# EAGLE design FAL65816_Backplane (EAGLE 7.2.0)
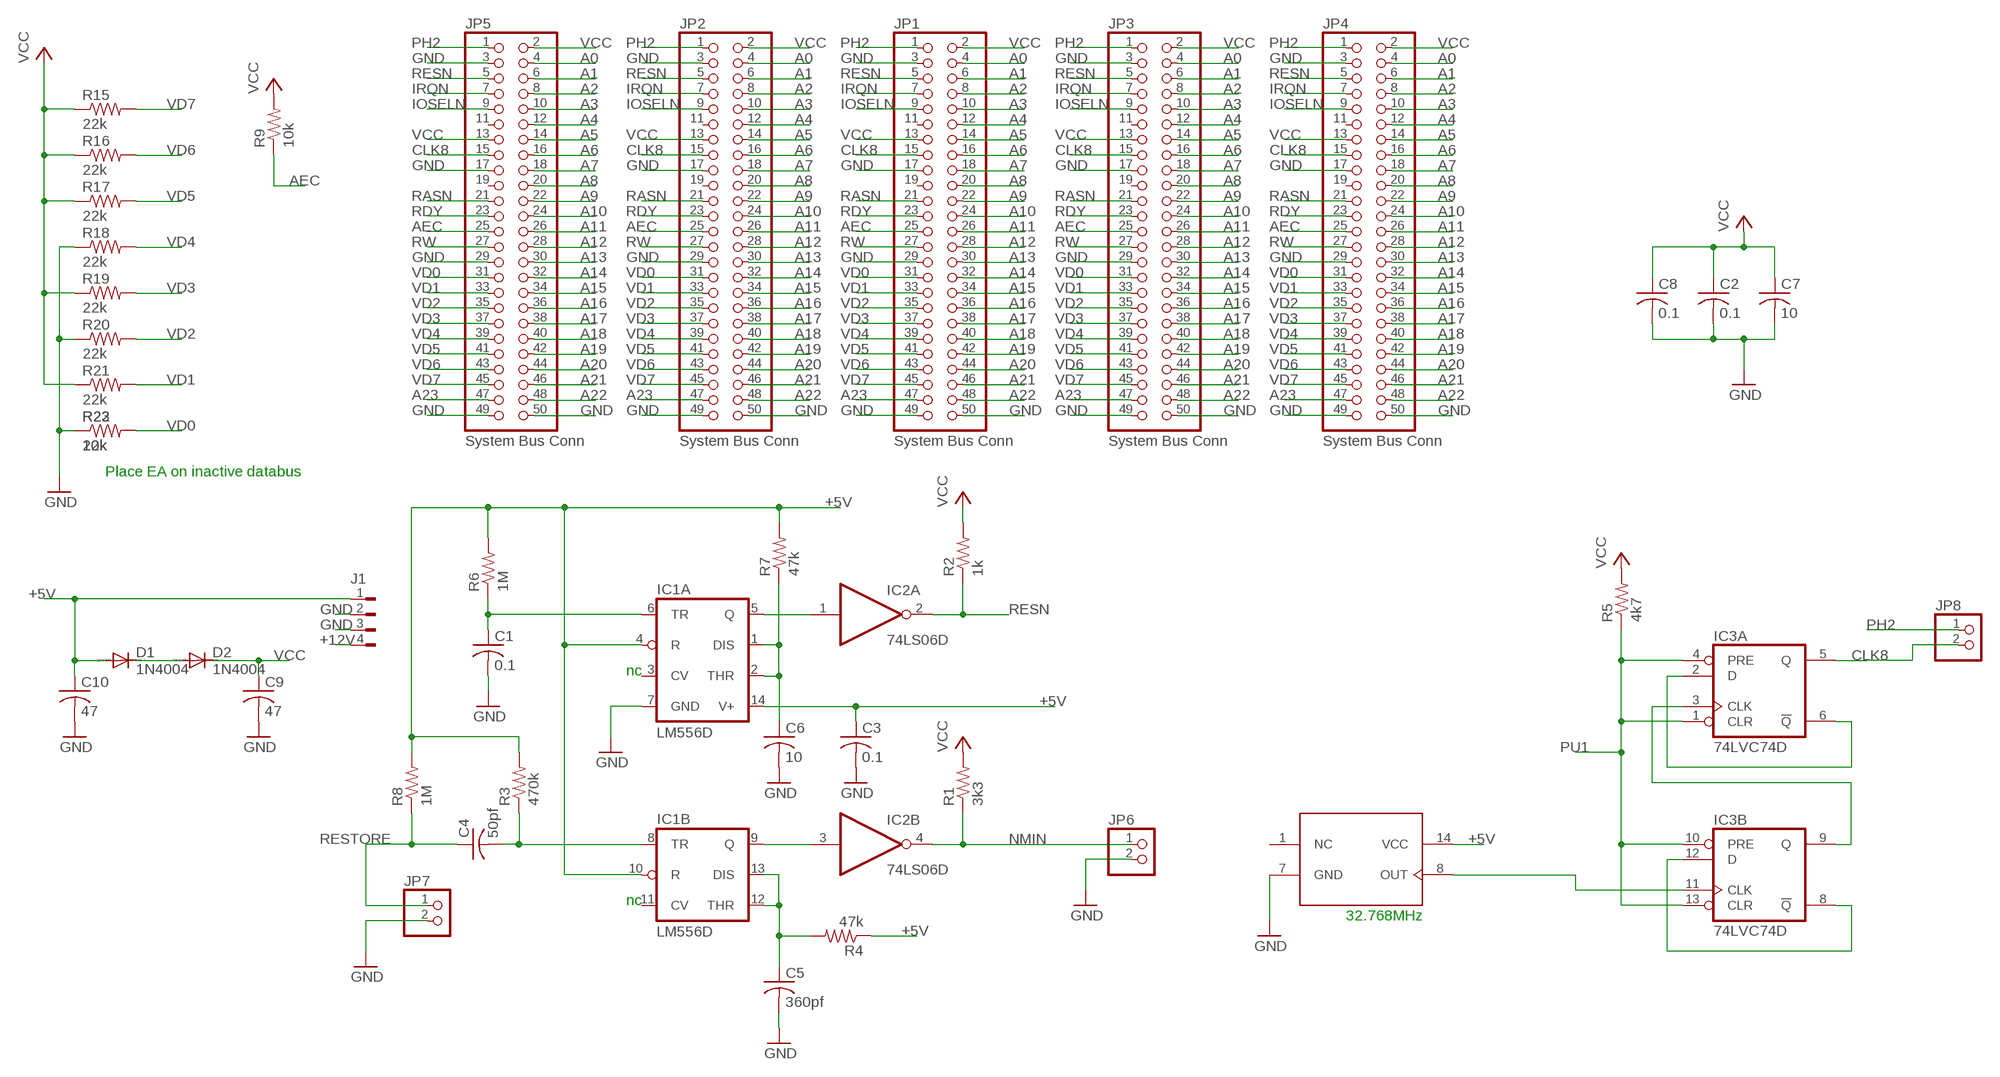
[diagram p0: schematic, sheet 1]

## Parts
C1  0.1  C-US050-024X044  [C050-024X044]
C2  0.1  C-US050-024X044  [C050-024X044]
C3  0.1  C-US050-024X044  [C050-024X044]
C4  50pf  C-US050-024X044  [C050-024X044]
C5  360pf  C-US050-024X044  [C050-024X044]
C6  10  C-US050-024X044  [C050-024X044]
C7  10  C-US050-024X044  [C050-024X044]
C8  0.1  C-US050-024X044  [C050-024X044]
C9  47  C-US050-024X044  [C050-024X044]
C10  47  C-US050-024X044  [C050-024X044]
D1  1N4004  [DO41-10]
D2  1N4004  [DO41-10]
IC1  LM556D  [SO14]
IC2  74LS06D  [SO14]
IC3  74LVC74D  74LS74D  [SO14]
J1  FLOPPY-4  [FLOPPY-4]
JP1  System Bus Conn  PINHD-2X25  [2X25]
JP2  System Bus Conn  PINHD-2X25  [2X25]
JP3  System Bus Conn  PINHD-2X25  [2X25]
JP4  System Bus Conn  PINHD-2X25  [2X25]
JP5  System Bus Conn  PINHD-2X25  [2X25]
JP6  PINHD-1X2  [1X02]
JP7  PINHD-1X2  [1X02]
JP8  PINHD-1X2  [1X02]
R1  3k3  R-US_0204/7  [0204/7]
R2  1k  R-US_0204/7  [0204/7]
R3  470k  R-US_0204/7  [0204/7]
R4  47k  R-US_0204/7  [0204/7]
R5  4k7  R-US_0204/7  [0204/7]
R6  1M  R-US_0204/7  [0204/7]
R7  47k  R-US_0204/7  [0204/7]
R8  1M  R-US_0204/7  [0204/7]
R9  10k  R-US_0204/7  [0204/7]
R15  22k  R-US_0207/10  [0207/10]
R16  22k  R-US_0207/10  [0207/10]
R17  22k  R-US_0207/10  [0207/10]
R18  22k  R-US_0207/10  [0207/10]
R19  22k  R-US_0207/10  [0207/10]
R20  22k  R-US_0207/10  [0207/10]
R21  22k  R-US_0207/10  [0207/10]
R22  10k  R-US_0207/10  [0207/10]
R23  22k  R-US_0207/10  [0207/10]
U$1  OSC14  [DIL14]

## Nets
+5V: C3.1 C10.1 D1.A IC1.4(A:R) IC1.10(B:R) IC1.14(A:V+) J1.1 R3.2 R4.1 R6.2 R7.2 R8.2 U$1.14(VCC)
+12V: J1.4
A0: JP1.4 JP2.4 JP3.4 JP4.4 JP5.4
A1: JP1.6 JP2.6 JP3.6 JP4.6 JP5.6
A2: JP1.8 JP2.8 JP3.8 JP4.8 JP5.8
A3: JP1.10 JP2.10 JP3.10 JP4.10 JP5.10
A4: JP1.12 JP2.12 JP3.12 JP4.12 JP5.12
A5: JP1.14 JP2.14 JP3.14 JP4.14 JP5.14
A6: JP1.16 JP2.16 JP3.16 JP4.16 JP5.16
A7: JP1.18 JP2.18 JP3.18 JP4.18 JP5.18
A8: JP1.20 JP2.20 JP3.20 JP4.20 JP5.20
A9: JP1.22 JP2.22 JP3.22 JP4.22 JP5.22
A10: JP1.24 JP2.24 JP3.24 JP4.24 JP5.24
A11: JP1.26 JP2.26 JP3.26 JP4.26 JP5.26
A12: JP1.28 JP2.28 JP3.28 JP4.28 JP5.28
A13: JP1.30 JP2.30 JP3.30 JP4.30 JP5.30
A14: JP1.32 JP2.32 JP3.32 JP4.32 JP5.32
A15: JP1.34 JP2.34 JP3.34 JP4.34 JP5.34
A16: JP1.36 JP2.36 JP3.36 JP4.36 JP5.36
A17: JP1.38 JP2.38 JP3.38 JP4.38 JP5.38
A18: JP1.40 JP2.40 JP3.40 JP4.40 JP5.40
A19: JP1.42 JP2.42 JP3.42 JP4.42 JP5.42
A20: JP1.44 JP2.44 JP3.44 JP4.44 JP5.44
A21: JP1.46 JP2.46 JP3.46 JP4.46 JP5.46
A22: JP1.48 JP2.48 JP3.48 JP4.48 JP5.48
A23: JP1.47 JP2.47 JP3.47 JP4.47 JP5.47
AEC: JP1.25 JP2.25 JP3.25 JP4.25 JP5.25 R9.1
CLK8: IC3.5(A:Q) JP1.15 JP2.15 JP3.15 JP4.15 JP5.15 JP8.2
GND: C1.2 C2.2 C3.2 C5.2 C6.2 C7.2 C8.2 C9.2 C10.2 IC1.7(A:GND) J1.2 J1.3 JP1.3 JP1.17 JP1.29 JP1.49 JP1.50 JP2.3 JP2.17 JP2.29 JP2.49 JP2.50 JP3.3 JP3.17 JP3.29 JP3.49 JP3.50 JP4.3 JP4.17 JP4.29 JP4.49 JP4.50 JP5.3 JP5.17 JP5.29 JP5.49 JP5.50 JP6.2 JP7.2 R18.1 R20.1 R22.1 R23.1 U$1.7(GND)
IOSELN: JP1.9 JP2.9 JP3.9 JP4.9 JP5.9
IRQN: JP1.7 JP2.7 JP3.7 JP4.7 JP5.7
N$2: IC3.3(A:CLK) IC3.9(B:Q)
N$3: IC1.5(A:Q) IC2.1(A:I)
N$4: IC3.8(B:!Q) IC3.12(B:D)
N$5: IC1.9(B:Q) IC2.3(B:I)
N$6: C1.1 IC1.6(A:TR) R6.1
N$7: IC3.11(B:CLK) U$1.8(OUT)
N$8: IC3.2(A:D) IC3.6(A:!Q)
N$9: R22.2 R23.2
N$10: C6.1 IC1.1(A:DIS) IC1.2(A:THR) R7.1
N$12: C4.2 IC1.8(B:TR) R3.1
N$13: D1.C D2.A
N$14: C5.1 IC1.12(B:THR) IC1.13(B:DIS) R4.2
NMIN: IC2.4(B:O) JP6.1 R1.1
PH2: JP1.1 JP2.1 JP3.1 JP4.1 JP5.1 JP8.1
PU1: IC3.1(A:CLR) IC3.4(A:PRE) IC3.10(B:PRE) IC3.13(B:CLR) R5.1
RASN: JP1.21 JP2.21 JP3.21 JP4.21 JP5.21
RDY: JP1.23 JP2.23 JP3.23 JP4.23 JP5.23
RESN: IC2.2(A:O) JP1.5 JP2.5 JP3.5 JP4.5 JP5.5 R2.1
RESTORE: C4.1 JP7.1 R8.1
RW: JP1.27 JP2.27 JP3.27 JP4.27 JP5.27
VCC: C2.1 C7.1 C8.1 C9.1 D2.C JP1.2 JP1.13 JP2.2 JP2.13 JP3.2 JP3.13 JP4.2 JP4.13 JP5.2 JP5.13 R1.2 R2.2 R5.2 R9.2 R15.1 R16.1 R17.1 R19.1 R21.1
VD0: JP1.31 JP2.31 JP3.31 JP4.31 JP5.31
VD1: JP1.33 JP2.33 JP3.33 JP4.33 JP5.33 R21.2
VD2: JP1.35 JP2.35 JP3.35 JP4.35 JP5.35 R20.2
VD3: JP1.37 JP2.37 JP3.37 JP4.37 JP5.37 R19.2
VD4: JP1.39 JP2.39 JP3.39 JP4.39 JP5.39 R18.2
VD5: JP1.41 JP2.41 JP3.41 JP4.41 JP5.41 R17.2
VD6: JP1.43 JP2.43 JP3.43 JP4.43 JP5.43 R16.2
VD7: JP1.45 JP2.45 JP3.45 JP4.45 JP5.45 R15.2
Unconnected: IC1.3(A:CV) IC1.11(B:CV) IC2.5(C:I) IC2.6(C:O) IC2.8(D:O) IC2.9(D:I) IC2.10(E:O) IC2.11(E:I) IC2.12(F:O) IC2.13(F:I) JP1.11 JP1.19 JP2.11 JP2.19 JP3.11 JP3.19 JP4.11 JP4.19 JP5.11 JP5.19 U$1.1(NC)

## Notes on the sheet
- Place EA on inactive databus
- nc
- nc
- 32.768MHz

## Power pins joined to a net without a drawn wire
GND: IC2.7(P:GND) IC3.7(P:GND)
VCC: IC2.14(P:VCC) IC3.14(P:VCC)

## Library data of the parts
C1-C10 = rcl:C-US: CAPACITOR, American symbol
D1 D2 = diode:1N4004: DIODE general purpose rectifier, 1 A
IC1 = linear:*556: Dual TIMER
IC2 = FT74xx:74*06: Hex INVERTER, open collector high-voltage output
IC3 = FT74xx:74*74: Dual D type positive edge triggered FLIP FLOP, preset and clear
J1 = con-amp:FLOPPY-4: MATE N-LOCK Floppy / HDD conector Distributor: Bürklin 71F970
JP1-JP5 = pinhead:PINHD-2X25: PIN HEADER
JP6-JP8 = pinhead:PINHD-1X2: PIN HEADER
R1-R9 R15-R23 = resistor:R-US_: RESISTOR, American symbol
U$1 = FT74xx:OSC14

## Board
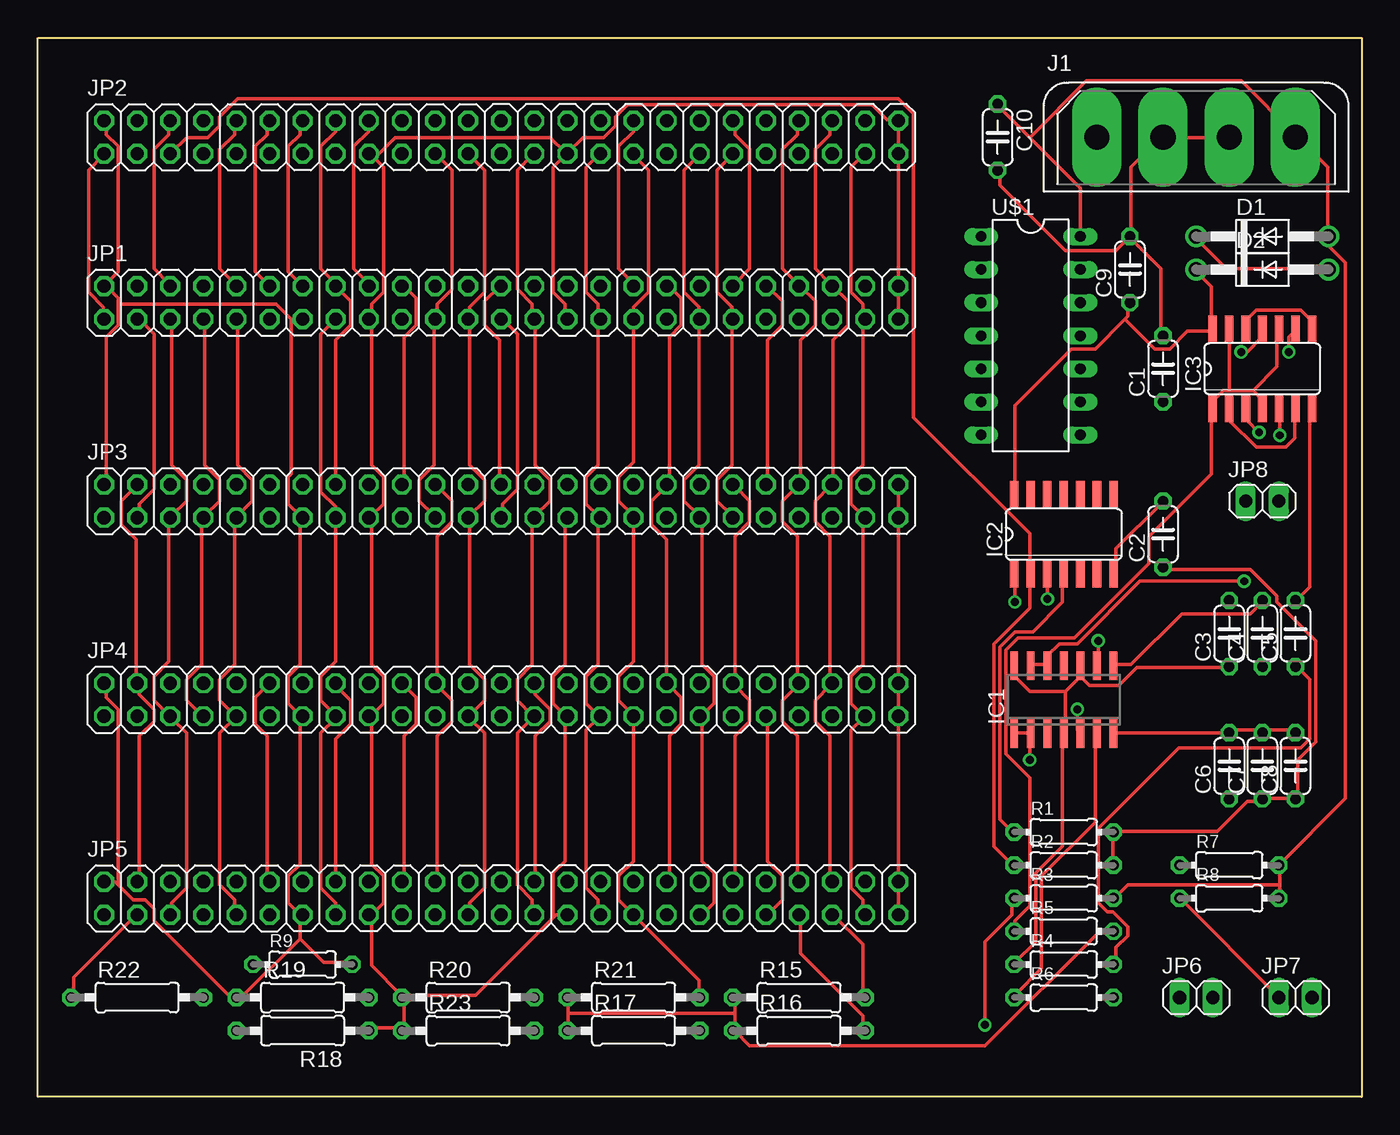
[diagram p1: board, top side]
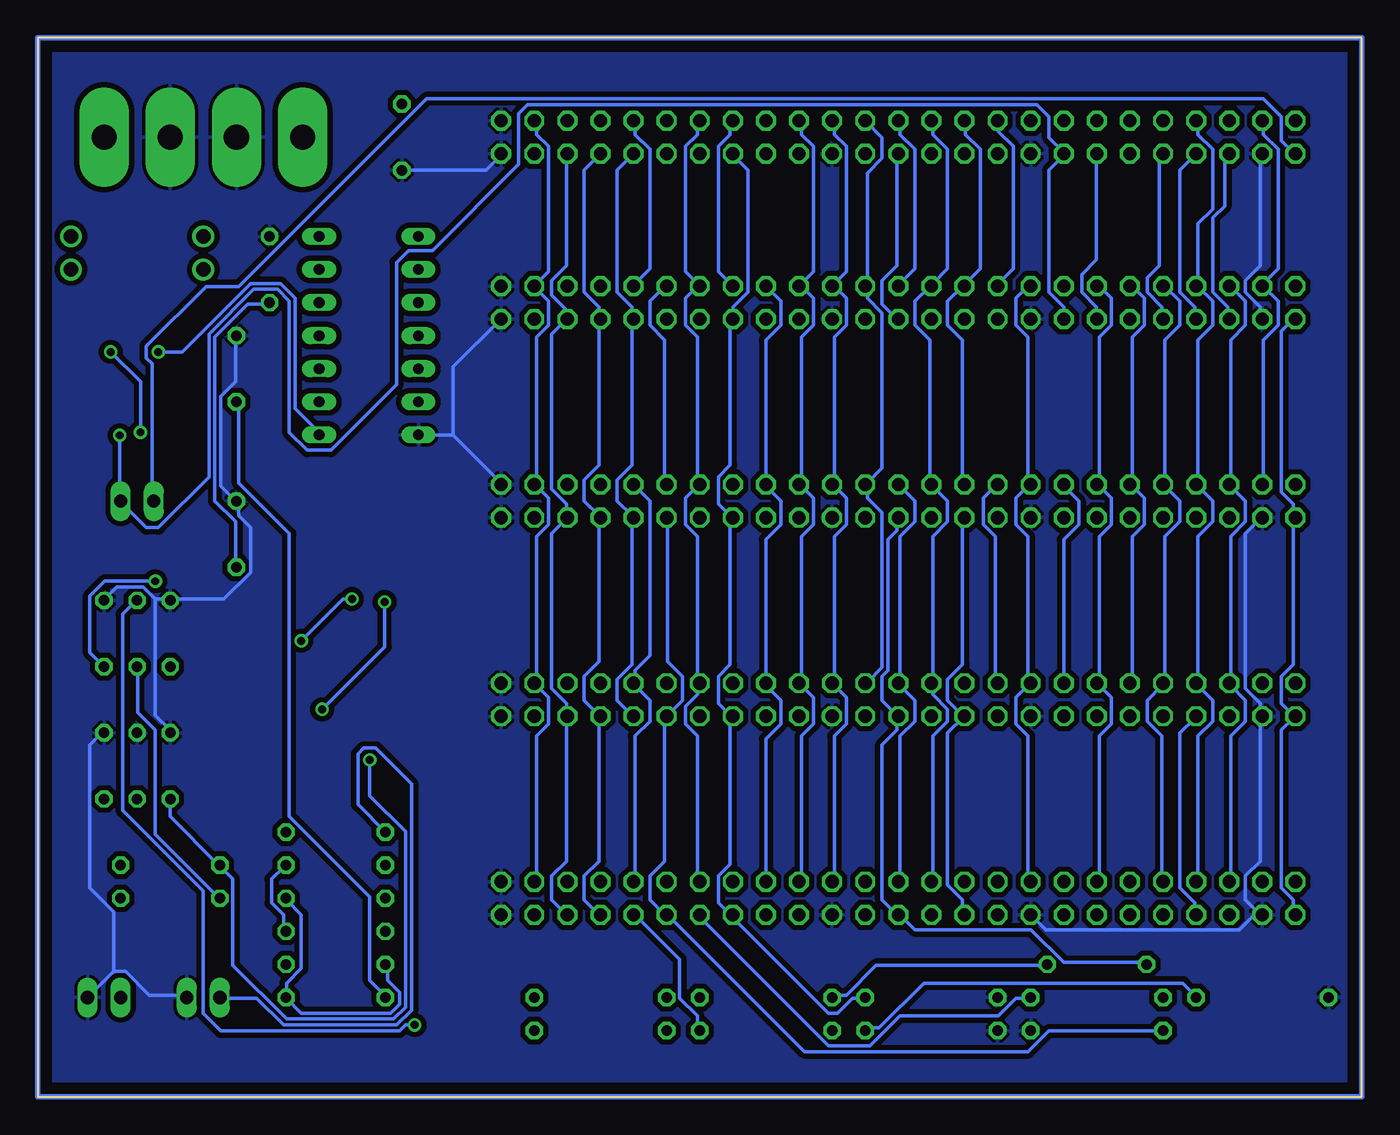
[diagram p2: board, bottom side, seen from below]

Size 101.6 x 81.28 mm. Coordinates in mm from the lower left corner, seen from the top.
Outline: 0,0 0,81.28 101.6,81.28 101.6,0 0,0
Copper layers (1*16): Top 0.035mm / dielectric 1.5mm / Bottom 0.035mm
Design rules "default": minimum track width 10mil, minimum drill 24mil, track to track 8mil, track to pad 8mil, pad to pad 8mil, via to via 8mil, smd to smd 8mil, copper to edge 40mil, drill to drill 8mil, minimum pad ring 10mil, minimum via ring 8mil, stop-mask expansion 4mil, vias tented up to drill 0mil, thermal gap 10mil

### Footprints (pad centres in the part's own frame; a part is rotated, then mirrored left to right if it is on the bottom)
C050-024X044 = drill 0.813 octagon: 1 -2.54,0; 2 2.54,0
DO41-10 = drill 1.118: A 5.08,0; C -5.08,0
SO14 = smd 0.6 x 2.2: 1 -3.81,-2.6; 2 -2.54,-2.6; 3 -1.27,-2.6; 4 0,-2.6; 5 1.27,-2.6; 6 2.54,-2.6; 7 3.81,-2.6; 8 3.81,2.6; 9 2.54,2.6; 10 1.27,2.6; 11 0,2.6; 12 -1.27,2.6; 13 -2.54,2.6; 14 -3.81,2.6
SO14' = smd 0.66 x 2.032: 1 -3.81,-3.073; 2 -2.54,-3.073; 3 -1.27,-3.073; 4 0,-3.073; 5 1.27,-3.073; 6 2.54,-3.073; 7 3.81,-3.073; 8 3.81,3.073; 9 2.54,3.073; 10 1.27,3.073; 11 0,3.073; 12 -1.27,3.073; 13 -2.54,3.073; 14 -3.81,3.073
FLOPPY-4 = drill 1.93 pad 3.81 long: 1 7.62,0; 2 2.54,0; 3 -2.54,0; 4 -7.62,0
2X25 = drill 1.016 octagon: 1 -30.48,-1.27; 2 -30.48,1.27; 3 -27.94,-1.27; 4 -27.94,1.27; 5 -25.4,-1.27; 6 -25.4,1.27; 7 -22.86,-1.27; 8 -22.86,1.27; 9 -20.32,-1.27; 10 -20.32,1.27; 11 -17.78,-1.27; 12 -17.78,1.27; 13 -15.24,-1.27; 14 -15.24,1.27; 15 -12.7,-1.27; 16 -12.7,1.27; 17 -10.16,-1.27; 18 -10.16,1.27; 19 -7.62,-1.27; 20 -7.62,1.27; 21 -5.08,-1.27; 22 -5.08,1.27; 23 -2.54,-1.27; 24 -2.54,1.27; 25 0,-1.27; 26 0,1.27; 27 2.54,-1.27; 28 2.54,1.27; 29 5.08,-1.27; 30 5.08,1.27; 31 7.62,-1.27; 32 7.62,1.27; 33 10.16,-1.27; 34 10.16,1.27; 35 12.7,-1.27; 36 12.7,1.27; 37 15.24,-1.27; 38 15.24,1.27; 39 17.78,-1.27; 40 17.78,1.27; 41 20.32,-1.27; 42 20.32,1.27; 43 22.86,-1.27; 44 22.86,1.27; 45 25.4,-1.27; 46 25.4,1.27; 47 27.94,-1.27; 48 27.94,1.27; 49 30.48,-1.27; 50 30.48,1.27
1X02 = drill 1.016 long: 1 -1.27,0; 2 1.27,0
0204/7 = drill 0.813 octagon: 1 -3.81,0; 2 3.81,0
0207/10 = drill 0.813 octagon: 1 -5.08,0; 2 5.08,0
DIL14 = drill 0.813 long: 1 -7.62,-3.81; 2 -5.08,-3.81; 3 -2.54,-3.81; 4 0,-3.81; 5 2.54,-3.81; 6 5.08,-3.81; 7 7.62,-3.81; 8 7.62,3.81; 9 5.08,3.81; 10 2.54,3.81; 11 0,3.81; 12 -2.54,3.81; 13 -5.08,3.81; 14 -7.62,3.81

### Placement (x,y rotation side)
C1  86.36,55.88 90 top
C2  86.36,43.18 90 top
C3  91.44,35.56 90 top
C4  93.98,35.56 90 top
C5  96.52,35.56 90 top
C6  91.44,25.4 90 top
C7  93.98,25.4 90 top
C8  96.52,25.4 90 top
C9  83.82,63.5 90 top
C10  73.66,73.66 270 top
D1  93.98,66.04 0 top
D2  93.98,63.5 0 top
IC1  78.74,30.48 0 top
IC2  74LS06D  [SO14']  78.74,43.18 0 top
IC3  74LVC74D  [SO14']  93.98,55.88 0 top
J1  88.9,73.66 0 top
JP1  35.56,60.96 0 top
JP2  35.56,73.66 0 top
JP3  35.56,45.72 0 top
JP4  35.56,30.48 0 top
JP5  35.56,15.24 0 top
JP6  88.9,7.62 0 top
JP7  96.52,7.62 0 top
JP8  93.98,45.72 0 top
R1  78.74,20.32 0 top
R2  78.74,17.78 0 top
R3  78.74,15.24 0 top
R4  78.74,10.16 0 top
R5  78.74,12.7 0 top
R6  78.74,7.62 0 top
R7  91.44,17.78 0 top
R8  91.44,15.24 0 top
R9  20.32,10.16 0 top
R15  58.42,7.62 0 top
R16  58.42,5.08 0 top
R17  45.72,5.08 0 top
R18  20.32,5.08 180 top
R19  20.32,7.62 0 top
R20  33.02,7.62 0 top
R21  45.72,7.62 0 top
R22  7.62,7.62 0 top
R23  33.02,5.08 0 top
U$1  76.2,58.42 270 top

### Tracks (layer width: path | path; a pad name or v marks a point on that pad's centre or on a via)
+5V
  Top 0.254: U$1.14 80.01,69.75 76.12,73.64 | 76.12,73.64 73.61,76.15 C10.1 | 76.12,73.64 80.47,77.98 92.35,77.98 96.47,73.86 J1.1 96.7,73.64 98.98,71.35 98.98,66.09 D1.A 99.21,65.86 99.21,65.18 100.36,64.03 100.36,22.88 R7.2 95.33,17.63 95.33,16.26 | 78.87,31.11 78.87,27.91 IC1.4 78.64,27.69 78.64,19.23 76.58,17.17 76.58,11.91 74.98,10.31 R4.1 | 80.01,32.26 78.87,31.11 | 80.01,32.26 IC1.10 80.01,32.94 | 78.87,31.11 76.12,31.11 74.98,32.26 74.98,32.94 IC1.14 | 80.01,32.26 80.7,31.57 82.98,31.57 84.35,32.94 91.44,32.94 C3.1 | 95.33,16.26 95.33,15.34 R8.2 | 95.33,16.26 83.67,16.26 82.75,15.34 R3.2
  Bottom 0.254: R3.2 82.53,15.11 81.38,13.97 81.38,9.86 82.53,8.71 82.53,7.8 R6.2 82.53,7.57 81.38,6.43 74.52,6.43 73.84,7.11 73.84,8.03 74.75,8.94 74.75,10.08 R4.1
A0
  Top 0.254: JP5.4 7.77,16.71 7.77,27.69 8.91,28.83 8.91,29.74 7.77,30.89 7.77,31.57 JP4.4 7.54,31.8 7.54,42.77 6.4,43.92 6.4,45.74 7.54,46.89 JP3.4
  Bottom 0.254: JP3.4 7.54,47.12 7.54,58.09 6.4,59.23 6.4,61.06 7.54,62.2 JP1.4 7.54,62.43 6.4,63.58 6.4,72.72 7.54,73.86 7.54,74.78 JP2.4
A1
  Top 0.254: JP2.6 10.06,74.78 10.06,73.86 8.91,72.72 8.91,63.58 10.06,62.43 JP1.6
  Bottom 0.254: JP5.6 10.06,16.71 10.06,27.69 8.91,28.83 8.91,30.43 10.06,31.57 JP4.6 10.06,31.8 10.06,43 8.91,44.14 8.91,45.74 JP3.6 10.06,47.12 10.06,58.09 8.91,59.23 8.91,61.06 10.06,62.2 JP1.6
A2
  Bottom 0.254: JP5.8 12.57,16.71 12.57,27.69 11.43,28.83 11.43,30.43 12.57,31.57 JP4.8 12.57,31.8 12.57,43 11.43,44.14 11.43,45.74 12.57,46.89 JP3.8 12.57,47.12 12.57,58.09 11.43,59.23 11.43,61.06 12.57,62.2 JP1.8 12.57,62.43 12.57,67.01 11.43,68.15 11.43,72.72 12.57,73.86 12.57,74.78 JP2.8
A3
  Top 0.254: JP2.10 15.09,74.78 15.09,73.86 13.95,72.72 13.95,63.58 15.09,62.43 JP1.10
  Bottom 0.254: JP5.10 15.32,16.71 15.32,27.69 16.46,28.83 16.46,30.43 15.32,31.57 JP4.10 15.09,31.8 15.09,43 13.95,44.14 13.95,45.74 15.09,46.89 JP3.10 15.09,47.12 15.09,58.09 13.95,59.23 13.95,61.06 15.09,62.2 JP1.10
A4
  Top 0.254: JP4.12 16.69,30.66 16.69,28.6 17.6,27.69 17.6,16.71 JP5.12 | JP2.12 17.6,74.78 17.6,73.86 16.69,72.95 16.69,63.35 17.6,62.43 JP1.12
  Bottom 0.254: JP1.12 17.6,62.2 16.69,61.29 16.69,59.23 17.6,58.32 17.6,47.12 JP3.12 17.6,46.89 16.69,45.97 16.69,43.92 17.6,43 17.6,31.8 JP4.12
A5
  Top 0.254: JP1.14 19.2,63.35 19.2,72.95 20.12,73.86 20.12,74.78 JP2.14
  Bottom 0.254: JP5.14 20.12,16.71 20.12,27.69 19.2,28.6 19.2,30.66 20.12,31.57 JP4.14 20.12,31.8 20.12,43 19.2,43.92 19.2,45.97 20.12,46.89 JP3.14 20.12,47.12 20.12,58.32 19.2,59.23 19.2,61.29 20.12,62.2 JP1.14
A6
  Top 0.254: JP5.16 22.86,27.46 24,28.6 24,30.43 22.86,31.57 JP4.16 | JP3.16 22.86,58.09 24,59.23 24,61.06 22.86,62.2 JP1.16 22.86,62.43 21.72,63.58 21.72,72.95 22.86,74.09 JP2.16
  Bottom 0.254: JP4.16 22.86,42.77 21.72,43.92 21.72,45.74 22.86,46.89 JP3.16
A7
  Top 0.254: JP2.18 25.38,74.78 25.38,74.09 24.23,72.95 24.23,63.58 25.38,62.43 JP1.18
  Bottom 0.254: JP5.18 25.6,16.71 25.6,27.69 26.52,28.6 26.52,30.66 25.6,31.57 JP4.18 25.6,31.8 25.6,43 26.52,43.92 26.52,45.97 25.6,46.89 JP3.18 25.6,47.12 25.6,58.32 26.52,59.23 26.52,61.29 25.6,62.2 JP1.18
A8
  Top 0.254: JP4.20 29.03,30.66 29.03,28.6 28.12,27.69 28.12,16.71 JP5.20 | JP3.20 28.12,47.12 28.12,58.32 29.03,59.23 29.03,61.29 28.12,62.2 JP1.20
  Bottom 0.254: JP2.20 27.89,74.78 27.89,74.09 26.75,72.95 26.75,63.58 27.89,62.43 JP1.20 | JP4.20 28.12,31.8 28.12,43 29.03,43.92 29.03,45.97 28.12,46.89 JP3.20
A9
  Top 0.254: JP5.22 30.63,16.71 30.63,27.69 31.77,28.83 31.77,30.43 30.63,31.57 JP4.22 30.63,31.8 30.63,43 31.77,44.14 31.77,45.74 30.63,46.89 JP3.22
  Bottom 0.254: JP3.22 30.63,47.12 30.63,58.09 31.77,59.23 31.77,61.06 30.63,62.2 JP1.22 30.4,62.43 29.26,63.58 29.26,72.72 30.4,73.86 30.4,74.78 JP2.22
A10
  Bottom 0.254: JP5.24 32.92,16.71 32.92,27.69 31.77,28.83 31.77,29.74 32.92,30.89 32.92,31.57 JP4.24 32.92,31.8 32.92,43 31.77,44.14 31.77,45.74 JP3.24 33.15,47.12 33.15,58.09 34.29,59.23 34.29,61.06 33.15,62.2 JP1.24 32.92,62.43 31.77,63.58 31.77,72.72 32.92,73.86 32.92,74.78 JP2.24
A11
  Top 0.254: JP3.26 35.43,47.12 35.43,58.09 34.29,59.23 34.29,61.06 35.43,62.2 JP1.26
  Bottom 0.254: JP5.26 35.43,16.71 35.43,27.69 34.29,28.83 34.29,30.43 35.43,31.57 JP4.26 35.43,31.8 35.43,43 34.29,44.14 34.29,45.74 35.43,46.89 JP3.26 | JP2.26 35.43,74.78 35.43,73.86 34.29,72.72 34.29,63.58 35.43,62.43 JP1.26
A12
  Top 0.254: JP5.28 38.18,16.71 38.18,27.69 39.32,28.83 39.32,29.74 38.18,30.89 38.18,31.57 JP4.28
  Bottom 0.254: JP2.28 36.8,73.64 36.8,72.03 37.95,70.89 37.95,62.43 JP1.28 37.95,62.2 37.95,61.29 36.8,60.15 36.8,48.26 37.95,47.12 JP3.28 37.95,46.89 37.95,45.97 36.8,44.83 36.8,32.94 37.95,31.8 JP4.28
A13
  Bottom 0.254: JP5.30 40.46,16.71 40.46,27.69 39.55,28.6 39.55,30.66 JP4.30 40.46,31.8 40.46,43 39.55,43.92 39.55,45.97 40.46,46.89 JP3.30 40.46,47.12 40.46,58.32 39.55,59.23 39.55,61.29 40.46,62.2 JP1.30 40.46,62.43 39.55,63.35 39.55,72.95 40.46,73.86 40.46,74.78 JP2.30
A14
  Bottom 0.254: JP5.32 42.98,16.71 42.98,27.69 42.06,28.6 42.06,30.66 42.98,31.57 JP4.32 42.98,31.8 42.98,43 42.06,43.92 42.06,45.97 42.98,46.89 JP3.32 42.98,47.12 42.98,58.32 42.06,59.23 42.06,61.29 42.98,62.2 JP1.32 42.06,63.35 42.06,72.95 42.98,73.86 42.98,74.78 JP2.32
A15
  Top 0.254: JP2.34 45.72,74.09 44.58,72.95 44.58,63.58 45.72,62.43 JP1.34
  Bottom 0.254: JP5.34 45.72,27.46 44.58,28.6 44.58,30.43 45.72,31.57 JP4.34 45.72,42.77 44.58,43.92 44.58,45.74 45.72,46.89 JP3.34 45.72,58.09 44.58,59.23 44.58,61.06 45.72,62.2 JP1.34
A16
  Top 0.254: JP5.36 48.46,16.71 48.46,27.69 49.38,28.6 49.38,30.66 48.46,31.57 JP4.36 48.23,31.8 48.23,42.77 47.09,43.92 47.09,45.74 48.23,46.89 JP3.36 48.46,47.12 48.46,58.32 49.38,59.23 49.38,61.29 48.46,62.2 JP1.36
  Bottom 0.254: JP1.36 49.38,63.35 49.38,72.95 48.46,73.86 48.46,74.78 JP2.36
A17
  Bottom 0.254: JP5.38 50.98,16.71 50.98,27.69 51.89,28.6 51.89,29.97 50.98,30.89 50.98,31.57 JP4.38 50.98,31.8 50.98,43 51.89,43.92 51.89,45.97 50.98,46.89 JP3.38 50.98,47.12 50.98,58.32 51.89,59.23 51.89,61.29 50.98,62.2 JP1.38 50.98,62.43 51.89,63.35 51.89,72.95 50.98,73.86 50.98,74.78 JP2.38
A18
  Top 0.254: JP5.40 53.49,16.71 53.49,27.69 54.63,28.83 54.63,30.43 53.49,31.57 JP4.40 53.49,31.8 53.49,43 54.63,44.14 54.63,45.74 53.49,46.89 JP3.40 | JP2.40 53.49,74.78 53.49,73.86 54.63,72.72 54.63,63.58 53.49,62.43 JP1.40
  Bottom 0.254: JP3.40 53.49,47.12 53.49,58.09 54.63,59.23 54.63,61.06 53.49,62.2 JP1.40
A19
  Top 0.254: JP3.42 56.01,47.12 56.01,58.09 57.15,59.23 57.15,61.06 56.01,62.2 JP1.42
  Bottom 0.254: JP5.42 55.78,16.71 55.78,27.69 54.63,28.83 54.63,30.43 55.78,31.57 JP4.42 55.78,31.8 55.78,32.72 54.63,33.86 54.63,45.74 JP3.42 | JP2.42 55.78,74.78 55.78,73.86 54.63,72.72 54.63,63.58 55.78,62.43 JP1.42
A20
  Top 0.254: JP5.44 58.29,16.71 58.29,27.69 57.15,28.83 57.15,30.43 58.29,31.57 JP4.44 58.29,31.8 58.29,43 57.15,44.14 57.15,45.74 58.29,46.89 JP3.44 58.52,47.12 58.52,58.09 59.66,59.23 59.66,61.06 58.52,62.2 JP1.44 58.29,62.43 57.15,63.58 57.15,72.72 58.29,73.86 58.29,74.78 JP2.44
A21
  Top 0.254: JP5.46 60.81,16.71 60.81,27.69 59.66,28.83 59.66,30.43 60.81,31.57 JP4.46 60.81,31.8 60.81,43 59.66,44.14 59.66,45.74 60.81,46.89 JP3.46 61.04,47.12 61.04,58.09 62.18,59.23 62.18,61.06 61.04,62.2 JP1.46 60.81,62.43 59.66,63.58 59.66,72.72 60.81,73.86 60.81,74.78 JP2.46
A22
  Bottom 0.254: JP5.48 63.32,16.71 63.32,27.69 62.41,28.6 62.41,30.66 JP4.48 63.32,31.8 63.32,43 62.41,43.92 62.41,45.97 63.32,46.89 JP3.48 63.32,47.12 63.32,58.32 62.41,59.23 62.41,61.06 63.55,62.2 JP1.48 63.32,62.43 62.41,63.35 62.41,72.95 63.32,73.86 63.32,74.78 JP2.48
A23
  Top 0.254: 63.32,59.69 63.32,60.83 62.41,61.75 62.41,71.35 63.32,72.26 JP2.47 | JP5.47 63.32,13.97 63.32,15.11 62.41,16.03 62.41,28.14 63.32,29.06 JP4.47 63.32,29.29 62.41,30.2 62.41,32.26 63.32,33.17 63.32,44.37 JP3.47 63.32,44.6 62.41,45.52 62.41,47.57 63.32,48.49 63.32,59.69 | 63.32,59.69 JP1.47
AEC
  Top 0.254: JP3.25 35.66,44.6 35.66,45.52 36.8,46.66 36.8,58.55 35.66,59.69 JP1.25
  Bottom 0.254: JP2.25 35.66,72.26 35.66,63.8 36.8,62.66 36.8,60.83 35.66,59.69 JP1.25 | R9.1 16.69,10.31 22.86,10.31 25.38,12.83 34.29,12.83 35.43,13.97 JP5.25 35.66,13.97 36.8,15.11 36.8,27 35.66,28.14 35.66,29.06 JP4.25 35.66,29.29 36.8,30.43 36.8,32.26 36.35,32.72 36.35,42.77 35.66,43.46 35.66,44.37 JP3.25
CLK8  (via drill 0.61)
  Top 0.254: JP5.15 22.86,14.88 21.72,16.03 21.72,27.91 22.86,29.06 JP4.15 22.86,29.29 21.72,30.43 21.72,32.26 22.86,33.4 JP3.15 22.86,45.29 21.72,46.43 21.72,58.55 JP1.15 | v95.33,50.77 95.33,52.6 IC3.5
  Bottom 0.254: v95.33,50.77 95.33,45.74 JP8.2 95.1,45.52 93.27,43.69 92.35,43.69 88.47,47.57 88.47,58.55 85.04,61.98 83.21,61.98 82.3,61.06 82.3,51 80.92,49.63 79.1,49.63 74.07,54.66 74.07,64.03 73.15,64.95 71.32,64.95 64.69,71.58 64.69,75.46 64.01,76.15 24.92,76.15 24,75.23 24,73.64 22.86,72.49 JP2.15 22.86,72.26 24,71.12 24,61.75 22.86,60.6 JP1.15
GND
  Top 0.254: JP5.49 66.06,13.97 66.06,16.48 JP5.50 66.06,16.71 66.06,29.06 JP4.49 66.06,29.29 66.06,31.57 JP4.50 66.06,31.8 66.06,44.37 JP3.49 66.06,44.6 66.06,46.89 JP3.50 | JP1.49 66.06,59.69 66.06,62.2 JP1.50 66.06,62.43 66.06,72.26 JP2.49 66.06,72.49 66.06,74.78 JP2.50 65.84,75.01 65.15,75.01 64.01,76.15 45.26,76.15 44.35,75.23 44.35,74.55 43.43,73.64 41.83,73.64 40.69,72.49 JP2.29 | C9.2 83.9,66.09 83.9,71.35 86.18,73.64 J1.3 86.41,73.64 91.44,73.64 J1.2 | C1.2 86.18,58.55 86.18,63.58 83.9,65.86 C9.2 | IC2.7 82.75,40.26 82.75,42.09 86.18,45.52 C2.2 | IC3.7 97.61,52.6 97.61,39.12 96.7,38.2 C5.2 | C8.2 96.47,28.14 94.18,28.14 C7.2 93.95,28.14 91.44,28.14 C6.2 91.44,27.91 82.75,27.91 IC1.7 | C10.2 73.84,71.12 73.84,69.98 78.87,64.95 82.75,64.95 83.67,65.86 C9.2 | R22.1 2.74,7.8 2.74,9.17 7.54,13.97 JP5.3 | JP3.3 7.77,44.6 7.77,45.52 8.91,46.66 8.91,58.55 7.77,59.69 JP1.3 | 25.6,59.69 25.6,60.83 26.52,61.75 26.52,71.35 25.83,72.03 | 25.83,72.03 25.6,72.26 JP2.17 25.83,72.03 | JP1.29 40.46,59.69 40.46,60.83 39.55,61.75 39.55,71.35 40.46,72.26 JP2.29 | 25.83,72.03 27.43,73.64 39.32,73.64 40.46,72.49 JP2.29 | R18.1 25.6,5.28 27.89,5.28 R23.1 28.12,5.28 28.12,7.57 R20.1 | 25.6,13.97 25.6,10.08 27.89,7.8 R20.1 | 25.6,13.97 26.52,14.88 26.52,16.94 25.6,17.86 25.6,29.06 JP4.17 25.6,29.29 26.52,30.2 26.52,32.26 25.6,33.17 25.6,44.37 JP3.17 25.6,44.6 26.52,45.52 26.52,47.57 25.6,48.49 25.6,59.69 | 25.6,13.97 JP5.17 | JP5.29 39.78,13.97 39.55,13.74 | 39.55,13.74 33.6,7.8 28.12,7.8 R20.1 | 39.55,13.74 39.55,17.17 40.46,18.09 40.46,29.06 JP4.29 40.46,29.29 39.55,30.2 39.55,32.26 40.46,33.17 40.46,44.37 JP3.29
  Top 0.254: 25.6,59.69 JP1.17
  Bottom 0.254: 69.72,50.77 72.24,50.77 U$1.7 | 69.72,50.77 66.06,47.12 JP3.50 | C10.2 67.21,71.12 66.06,72.26 JP2.49 | 69.72,50.77 69.72,56.03 66.06,59.69 JP1.49 | 92.58,38.2 91.44,38.2 | 92.58,38.2 93.5,39.12 95.56,39.12 96.47,38.2 C5.2 | 91.44,38.2 87.33,38.2 85.27,40.26 85.27,43.69 86.18,44.6 86.18,45.52 C2.2 86.41,45.74 87.55,46.89 87.55,53.75 86.41,54.89 86.41,58.32 C1.2 | 91.44,38.2 C3.2 | 95.78,9.63 94.87,9.63 93.04,7.8 90.3,7.8 JP6.2 | JP7.2 95.78,9.63 | 95.78,9.63 95.78,14.2 97.61,16.03 97.61,27 96.7,27.91 C8.2 | 92.58,38.2 92.58,29.29 91.44,28.14 C6.2 | 8,14.2 7.77,13.97 JP5.3 8,14.2 | 8,14.2 8.91,15.11 8.91,16.94 7.77,18.09 7.77,29.06 JP4.3 7.77,29.29 7.77,30.2 8.91,31.34 8.91,43.23 7.77,44.37 JP3.3 | JP2.3 7.77,72.26 7.77,63.8 8.91,62.66 8.91,61.75 7.77,60.6 7.77,59.69 JP1.3 | 8,14.2 9.37,12.83 24.23,12.83 25.38,13.97 JP5.17
  pour Bottom (isolate 0.406): 0,81.28 101.6,81.28 101.6,0 0,0
IOSELN
  Top 0.254: JP5.9 15.09,13.97 15.09,15.11 13.95,16.26 13.95,27.91 JP4.9 15.09,29.29 13.95,30.43 13.95,32.03 15.09,33.17 15.09,44.37 JP3.9 15.32,44.6 16.46,45.74 16.46,47.35 15.32,48.49 15.32,59.69 JP1.9
  Bottom 0.254: JP1.9 15.32,59.69 15.32,60.6 16.46,61.75 16.46,62.89 15.54,63.8 15.54,72.03 15.32,72.26 JP2.9
IRQN
  Top 0.254: JP4.7 12.57,29.29 11.43,30.43 11.43,32.03 12.57,33.17 12.57,44.37 JP3.7 12.8,44.6 13.95,45.74 13.95,47.35 12.8,48.49 12.8,59.69 JP1.7
  Bottom 0.254: JP1.7 12.8,59.69 12.8,60.6 13.95,61.75 13.95,71.12 12.8,72.26 JP2.7 | JP5.7 12.8,13.97 12.8,14.88 13.95,16.03 13.95,27.91 12.8,29.06 JP4.7
N$1
  Bottom 0.406: 0,0 0,81.28 101.6,81.28 101.6,0 0,0
N$2  (via drill 0.61)
  Top 0.254: v93.73,51 92.81,51.92 92.81,52.6 IC3.3 | v96.01,57.17 96.01,58.32 96.47,58.78 IC3.9
  Bottom 0.254: v93.73,51 93.73,54.89 v96.01,57.17
N$3  (via drill 0.61)
  Top 0.254: v74.98,37.97 74.98,40.03 IC2.1 | v79.78,29.74 79.78,28.14 80.01,27.91 IC1.5
  Bottom 0.254: v74.98,37.97 74.98,34.54 v79.78,29.74
N$4
  Top 0.254: IC3.12 92.81,59 92.81,59.69 93.5,60.38 96.93,60.38 97.61,59.69 97.61,59 IC3.8
N$5  (via drill 0.61)
  Top 0.254: v77.5,38.2 77.5,40.03 IC2.3 | v81.38,35 81.38,33.17 IC1.9
  Bottom 0.254: v77.5,38.2 78.18,38.2 v81.38,35
N$6
  Top 0.254: IC1.6 81.15,27.69 81.15,21.06 77.04,16.94 77.04,9.86 74.98,7.8 R6.1
  Bottom 0.254: C1.1 86.18,53.29 86.18,47.12 82.3,43.23 82.3,21.51 76.12,15.34 76.12,8.94 74.98,7.8 R6.1
N$7  (via drill 0.61)
  Top 0.254: v92.35,57.17 92.81,57.17 93.95,58.32 93.95,58.78 IC3.11
  Bottom 0.254: v92.35,57.17 90.53,57.17 85.27,62.43 82.98,62.43 81.84,61.29 81.84,52.83 80.01,51 U$1.8
N$8
  Top 0.254: IC3.2 91.44,51.92 93.5,49.86 95.78,49.86 96.47,50.55 96.47,52.6 IC3.6
N$9
  Bottom 0.254: R23.2 37.95,5.28 37.03,5.28 33.6,8.71 13.72,8.71 12.8,7.8 R22.2
N$10  (via drill 0.61)
  Top 0.254: IC1.1 74.98,27.91 76.12,27.91 IC1.2 76.12,27.69 v76.12,25.86
  Bottom 0.254: v76.12,25.86 76.12,23.11 73.38,20.37 73.38,6.88 74.3,5.97 82.53,5.97 86.64,10.08 86.64,16.71 87.55,17.63 R7.1 87.78,17.86 91.44,21.51 C6.1
N$12  (via drill 0.61)
  Top 0.254: IC1.8 82.75,33.17 83.9,33.17 87.78,37.06 93.04,37.06 93.95,37.97 C4.2 | v72.69,5.51 72.69,11.91 74.75,13.97 74.75,15.11 R3.1
  Bottom 0.254: v72.69,5.51 73.38,5.51 73.84,5.05 87.55,5.05 88.92,6.43 88.92,15.8 95.1,21.97 95.1,37.06 94.18,37.97 C4.2
N$13
  Top 0.254: D2.A 98.98,63.58 91.21,63.58 88.92,65.86 D1.C
N$14  (via drill 0.61)
  Top 0.254: IC1.13 76.35,33.17 77.27,33.17 IC1.12 77.5,33.17 77.5,33.86 78.41,34.77 79.78,34.77 84.58,39.57 v92.58,39.57 | R4.2 82.75,10.31 82.75,11.45 83.67,12.37 83.67,13.06 82.53,14.2 82.07,14.2 81.38,14.88 81.38,20.6 87.55,26.77 96.93,26.77 97.61,27.46 97.61,32.03 96.7,32.94 C5.1
  Bottom 0.254: v92.58,39.57 96.47,39.57 97.61,38.43 97.61,34.09 96.7,33.17 C5.1
NMIN
  Top 0.254: IC2.4 78.64,40.03 78.64,37.97 76.35,35.69 74.98,35.69 73.84,34.54 73.84,21.29 74.75,20.37 R1.1
  Bottom 0.254: R1.1 77.04,22.43 77.04,26.31 76.58,26.77 75.67,26.77 72.92,24.03 72.92,6.66 74.07,5.51 82.75,5.51 84.81,7.57 87.55,7.57 JP6.1
PH2
  Top 0.254: JP1.1 5.03,59.69 5.03,60.6 3.89,61.75 3.89,71.12 5.03,72.26 JP2.1
  Bottom 0.254: JP5.1 5.26,13.97 5.26,15.11 6.17,16.03 6.17,28.14 5.26,29.06 JP4.1 5.26,29.29 6.17,30.2 6.17,32.26 5.26,33.17 5.26,44.37 JP3.1 5.26,44.6 5.26,45.52 6.17,46.43 6.17,58.78 5.26,59.69 JP1.1 | JP8.1 92.81,45.74 92.81,56.26 93.27,56.72 93.27,57.63 88.7,62.2 86.18,62.2 71.78,76.61 7.54,76.61 6.17,75.23 6.17,73.41 5.26,72.49 JP2.1
PU1
  Top 0.254: 93.27,54.2 91.44,54.2 | 91.44,54.2 90.98,54.2 90.3,53.52 90.3,52.83 IC3.1 90.07,52.6 90.07,47.8 85.27,43 85.27,40.95 79.55,35.23 75.21,35.23 74.3,34.31 74.3,26.31 76.12,24.49 76.12,14.66 74.98,13.51 74.98,12.83 R5.1 | 93.27,54.2 93.95,53.52 93.95,52.83 IC3.4 | 91.44,54.2 IC3.13 | 93.27,54.2 95.1,56.03 95.1,58.78 IC3.10
RASN
  Top 0.254: JP2.21 30.63,72.26 31.77,71.12 31.77,61.98 30.63,60.83 30.63,59.69 JP1.21 30.4,59.69 30.4,48.49 29.26,47.35 29.26,45.74 30.4,44.6 JP3.21
  Bottom 0.254: JP5.21 30.63,13.97 30.63,15.11 31.77,16.26 31.77,27.91 JP4.21 30.63,29.29 31.77,30.43 31.77,32.03 30.63,33.17 30.63,44.37 JP3.21
RDY
  Top 0.254: 33.15,59.69 33.15,60.6 34.29,61.75 34.29,71.12 JP2.23 | JP5.23 33.15,13.97 33.15,14.88 34.29,16.03 34.29,27.91 33.15,29.06 JP4.23 33.15,29.29 34.29,30.43 34.29,32.03 33.15,33.17 33.15,44.37 JP3.23 33.15,44.6 34.29,45.74 34.29,47.35 33.15,48.49 33.15,59.69 | 33.15,59.69 JP1.23
RESN
  Top 0.254: R2.1 74.75,17.86 73.38,19.23 73.38,34.77 76.12,37.52 76.12,40.03 IC2.2 76.12,40.26 76.12,43.23 67.21,52.15 67.21,75.46 66.06,76.61 15.32,76.61 13.95,75.23 13.95,74.55 13.03,73.64 11.43,73.64 10.29,72.49 JP2.5 | JP5.5 10.29,13.97 10.29,14.88 11.43,16.03 11.43,27.91 10.29,29.06 JP4.5 10.06,29.29 8.91,30.43 8.91,32.26 10.06,33.4 10.06,44.37 JP3.5 10.29,44.6 11.43,45.74 11.43,47.35 10.29,48.49 10.29,59.69 JP1.5
  Bottom 0.254: JP2.5 10.52,72.03 10.52,68.38 11.43,67.46 11.43,61.75 10.29,60.6 10.29,59.69 JP1.5
RESTORE
  Top 0.254: R8.1 87.78,15.11 95.1,7.8 JP7.1
  Bottom 0.254: C4.1 93.95,32.94 93.95,29.52 92.58,28.14 92.58,20.14 87.78,15.34 R8.1
RW
  Top 0.254: JP2.27 37.95,72.26 36.8,71.12 36.8,61.98 37.95,60.83 37.95,59.69 JP1.27 38.18,59.69 38.18,48.49 39.32,47.35 39.32,45.74 38.18,44.6 JP3.27 37.95,44.37 37.95,33.17 36.8,32.03 36.8,30.43 37.95,29.29 JP4.27 36.8,27.91 36.8,16.26 37.95,15.11 37.95,13.97 JP5.27
VCC
  Top 0.254: R2.2 82.53,17.86 82.53,20.14 R1.2 82.75,20.37 90.53,20.37 92.81,22.66 93.95,22.66 C7.1 94.18,22.88 96.47,22.88 C8.1 96.7,22.88 96.7,25.86 98.07,27.23 98.07,35 95.1,37.97 95.1,38.43 93.04,40.49 86.41,40.49 C2.1 | D2.C 88.92,63.35 90.07,62.2 90.07,59 IC3.14 90.07,58.78 88.24,58.78 86.87,57.4 85.72,57.4 83.44,59.69 | 83.44,59.69 83.67,59.92 83.67,60.83 C9.1 | 83.44,59.69 81.15,57.4 79.32,57.4 74.98,53.06 74.98,46.43 IC2.14 | 6.17,60.83 6.17,61.29 5.26,62.2 JP1.2 5.26,62.43 6.17,63.35 6.17,72.95 5.26,73.86 5.26,74.78 JP2.2 | 6.17,60.83 6.17,59.23 5.26,58.32 5.26,47.12 JP3.2 | 19.43,59.69 JP1.13 | 19.43,59.69 18.29,60.83 6.17,60.83 | 40.69,6.43 40.69,7.57 R21.1 | 40.69,6.43 40.69,5.28 R17.1 | 53.49,6.43 53.49,7.57 R15.1 | 53.49,6.43 53.49,5.28 R16.1 53.49,5.05 54.63,3.91 72.69,3.91 81.38,12.6 82.53,12.6 R5.2 | 53.49,6.43 40.69,6.43 | 20.12,12.14 15.77,7.8 15.32,7.8 R19.1 15.09,7.8 14.63,7.8 8.91,13.51 8.91,14.43 8.23,15.11 7.32,15.11 6.17,16.26 | 20.12,13.97 20.12,12.14 | 20.12,12.14 21.95,10.31 24,10.31 R9.2 | 6.17,16.26 5.94,16.48 5.26,16.48 JP5.2 | 20.12,13.97 19.2,14.88 19.2,16.94 20.12,17.86 20.12,29.06 JP4.13 20.12,29.29 19.2,30.2 19.2,32.26 20.12,33.17 20.12,44.37 JP3.13 20.12,44.6 19.2,45.52 19.2,47.57 19.43,47.8 19.43,59.69 | 20.12,13.97 JP5.13 | 6.17,16.26 6.17,29.74 5.26,30.66 5.26,31.57 JP4.2
  Bottom 0.254: R5.2 82.75,12.83 82.75,13.97 83.67,14.88 83.67,16.71 82.75,17.63 R2.2 | C2.1 86.41,40.72 86.41,44.14 88.01,45.74 88.01,58.32 85.5,60.83 83.9,60.83 C9.1 | JP1.13 20.34,59.69 20.34,60.6 21.49,61.75 21.49,63.12 20.34,64.26 20.34,72.26 JP2.13 | R21.1 40.46,7.8 39.55,7.8 37.26,10.08 24.23,10.08 R9.2
VD0
  Top 0.254: 42.98,59.69 42.98,60.83 42.06,61.75 42.06,71.35 42.98,72.26 JP2.31 | JP5.31 42.98,13.97 42.98,15.11 42.06,16.03 42.06,28.14 42.98,29.06 JP4.31 42.98,29.29 42.06,30.2 42.06,32.26 42.98,33.17 42.98,44.37 JP3.31 42.98,44.6 42.06,45.52 42.06,47.57 42.98,48.49 42.98,59.69 | 42.98,59.69 JP1.31
VD1
  Top 0.254: JP2.33 45.72,72.26 46.86,71.12 46.86,61.75 45.72,60.6 JP1.33 45.72,48.72 44.58,47.57 44.58,45.74 45.72,44.6 JP3.33 45.72,33.4 44.58,32.26 44.58,30.43 45.72,29.29 JP4.33 45.72,18.09 44.58,16.94 44.58,15.11 JP5.33 50.75,8.94 50.75,7.8 R21.2
VD2
  Bottom 0.254: JP2.35 48.23,72.26 47.09,71.12 47.09,61.75 48.23,60.6 48.23,59.69 JP1.35 48.46,59.69 48.46,48.49 49.38,47.57 49.38,45.52 48.46,44.6 JP3.35 48.46,44.37 48.46,33.17 49.38,32.26 49.38,30.2 48.46,29.29 JP4.35 48.46,29.06 48.46,17.86 49.38,16.94 49.38,14.88 48.46,13.97 | 48.46,13.97 40.92,6.43 40.23,6.43 39.09,7.57 38.18,7.57 R20.2 | 48.46,13.97 JP5.35
VD3
  Top 0.254: 50.75,59.69 50.75,60.6 49.61,61.75 49.61,71.12 50.75,72.26 JP2.37 | JP5.37 50.98,13.97 51.89,14.88 51.89,17.17 50.98,18.09 50.98,29.06 JP4.37 50.98,29.29 51.89,30.2 51.89,32.26 50.98,33.17 50.98,44.37 JP3.37 50.75,44.6 49.61,45.74 49.61,47.35 50.75,48.49 50.75,59.69 | 50.75,59.69 JP1.37
  Bottom 0.254: R19.2 25.6,7.57 26.52,7.57 27.89,6.2 35.43,6.2 37.72,3.91 40.92,3.91 50.98,13.97 JP5.37
VD4
  Top 0.254: 53.26,59.69 53.26,60.6 52.12,61.75 52.12,71.12 53.26,72.26 JP2.39 | 53.26,59.69 53.26,48.49 52.12,47.35 52.12,45.74 53.26,44.6 JP3.39 | 53.26,59.69 JP1.39
  Bottom 0.254: R18.2 15.32,5.05 24,5.05 25.6,3.45 42.75,3.45 53.26,13.97 JP5.39 53.49,13.97 54.63,15.11 54.63,16.94 53.49,18.09 53.49,29.06 JP4.39 52.12,30.43 52.12,32.26 53.26,33.4 53.26,44.37 JP3.39
VD5
  Top 0.254: JP4.41 56.01,29.06 56.01,18.09 57.15,16.94 57.15,15.11 56.01,13.97 JP5.41
  Bottom 0.254: 56.01,59.69 56.01,60.6 57.15,61.75 57.15,71.12 JP2.41 | R17.2 50.98,5.28 50.98,6.2 52.35,7.57 52.35,10.54 55.78,13.97 JP5.41 | JP4.41 56.01,29.29 57.15,30.43 57.15,32.03 56.01,33.17 56.01,44.37 JP3.41 56.01,44.6 57.15,45.74 57.15,47.35 56.01,48.49 56.01,59.69 | 56.01,59.69 JP1.41
VD6
  Top 0.254: R16.2 63.32,5.28 63.32,6.2 58.52,11 58.52,13.97 JP5.43
  Bottom 0.254: 58.52,59.69 58.52,60.6 59.66,61.75 59.66,71.12 58.52,72.26 JP2.43 | JP5.43 58.52,13.97 59.66,15.11 59.66,16.94 58.52,18.09 58.52,29.06 JP4.43 58.52,29.29 59.66,30.43 59.66,32.26 58.52,33.4 58.52,44.37 JP3.43 58.52,44.6 59.66,45.74 59.66,47.35 58.52,48.49 58.52,59.69 | 58.52,59.69 JP1.43
VD7
  Top 0.254: R15.2 63.32,7.8 63.32,11.68 61.04,13.97 JP5.45
  Bottom 0.254: JP5.45 61.04,13.97 62.18,15.11 62.18,16.94 61.04,18.09 61.04,29.06 JP4.45 61.04,29.29 61.04,30.2 62.18,31.34 62.18,43.23 JP3.45 61.04,44.6 61.04,45.52 62.18,46.66 62.18,58.55 61.04,59.69 | 61.04,59.69 61.04,60.38 62.18,61.52 62.18,62.66 61.04,63.8 61.04,72.26 JP2.45 | 61.04,59.69 JP1.45